# Altium project Zigbee_CC2538_GW.PrjPcb
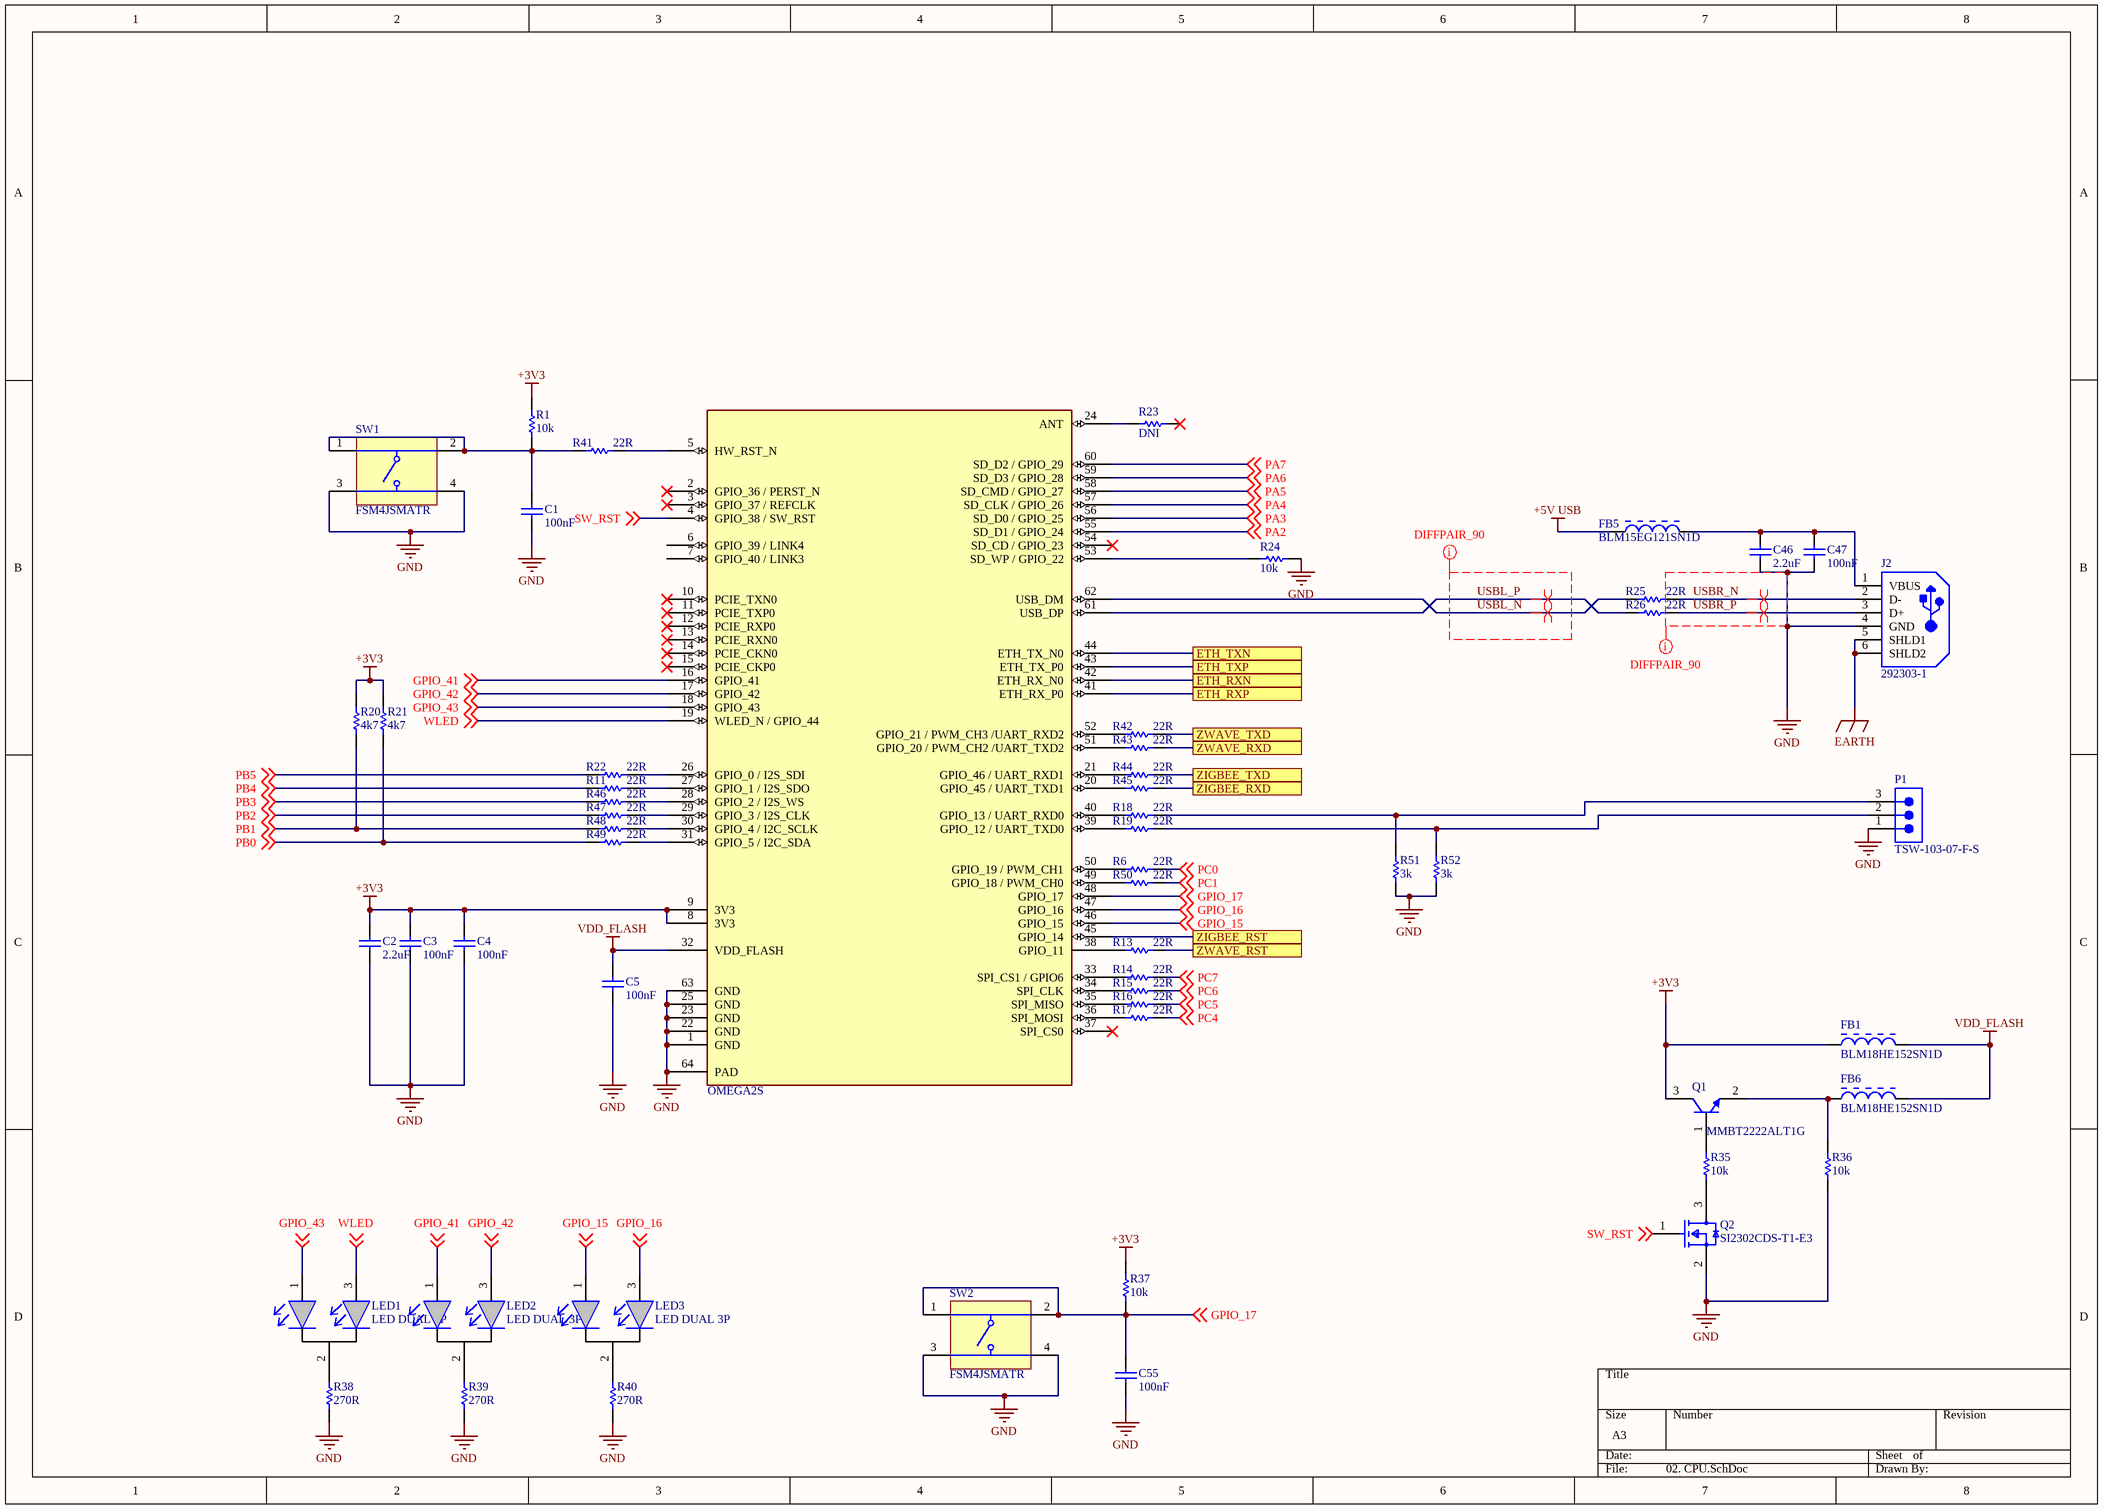
[diagram p0: 02. CPU.SchDoc]
6 sheets, 135 parts. Net scope: flat (ports and power ports of the same name join across sheets).
Board file: Zigbee_GW.PcbDoc
Sheets:
  02. CPU.SchDoc
  03. ZIGBEE.SchDoc
  01. MAIN.SchDoc
  04. Z-WAVE.SchDoc
  06. ETHERNET.SchDoc
  07. POWER.SchDoc

## Sheet 02. CPU.SchDoc
size A3

### Parts
C1  100nF  [CAPC1005X56X25NL10T15]
C2  2.2uF  [CAPC1608X90X35NL10T15]
C3  100nF  [CAPC1005X56X25NL10T15]
C4  100nF  [CAPC1005X56X25NL10T15]
C5  100nF  [CAPC1005X56X25NL10T15]
C46  2.2uF  [CAPC1608X90X35NL10T15]
C47  100nF  [CAPC1005X56X25NL10T15]
C55  100nF  [CAPC1005X56X25NL10T15]
FB1  BLM18HE152SN1D  [MURA-BLM18-RF-H4-CHIP-2_V]
FB5  BLM15EG121SN1D  [MURA-BLM15-CHIP-2_V]
FB6  BLM18HE152SN1D  [MURA-BLM18-RF-H4-CHIP-2_V]
J2  292303-1  [TE-292303-1_V]
LED1  LED DUAL 3P  [LED 3P 2.54]
LED2  LED DUAL 3P  [LED 3P 2.54]
LED3  LED DUAL 3P  [LED 3P 2.54]
P1  TSW-103-07-F-S  [SMTC-TSW-103-07-X-S]
Q1  MMBT2222ALT1G  [ONSC-SOT-23-3-318-08_V]
Q2  SI2302CDS-T1-E3  [FP-S-03946-MFG]
R1  10k  [RESC1005X40X25NL05T05]
R6  22R  [RESC1005X40X25LL05T05]
R11  22R  [RESC1005X40X25LL05T05]
R13  22R  [RESC1005X40X25LL05T05]
R14  22R  [RESC1005X40X25LL05T05]
R15  22R  [RESC1005X40X25LL05T05]
R16  22R  [RESC1005X40X25LL05T05]
R17  22R  [RESC1005X40X25LL05T05]
R18  22R  [RESC1005X40X25LL05T05]
R19  22R  [RESC1005X40X25LL05T05]
R20  4k7  [RESC1005X40X25NL05T05]
R21  4k7  [RESC1005X40X25NL05T05]
R22  22R  [RESC1005X40X25LL05T05]
R23  DNI  [RESC1005X40X25NL05T05]
R24  10k  [RESC1005X40X25NL05T05]
R25  22R  [RESC1005X40X25NL05T05]
R26  22R  [RESC1005X40X25NL05T05]
R35  10k  [RESC1005X40X25NL05T05]
R36  10k  [RESC1005X40X25NL05T05]
R37  10k  [RESC1005X40X25NL05T05]
R38  270R  [RESC1609X55X30NL15T15]
R39  270R  [RESC1609X55X30NL15T15]
R40  270R  [RESC1609X55X30NL15T15]
R41  22R  [RESC1005X40X25LL05T05]
R42  22R  [RESC1005X40X25LL05T05]
R43  22R  [RESC1005X40X25LL05T05]
R44  22R  [RESC1005X40X25LL05T05]
R45  22R  [RESC1005X40X25LL05T05]
R46  22R  [RESC1005X40X25LL05T05]
R47  22R  [RESC1005X40X25LL05T05]
R48  22R  [RESC1005X40X25LL05T05]
R49  22R  [RESC1005X40X25LL05T05]
R50  22R  [RESC1005X40X25LL05T05]
R51  3k  [RESC1005X40X25LL05T05]
R52  3k  [RESC1005X40X25LL05T05]
SW1  FSM4JSMATR  [TECO-FSM4JSMATR_V]
SW2  FSM4JSMATR  [TECO-FSM4JSMATR_V]
  OMEGA2S  [OMEGA2S]

### Ports
ETH_RXN, ETH_RXP, ETH_TXN, ETH_TXP, ZIGBEE_RST, ZIGBEE_RXD, ZIGBEE_TXD, ZWAVE_RST, ZWAVE_RXD, ZWAVE_TXD

### Nets
+3V3: C2.2 C3.2 C4.2 FB1.1 Q1.3(C) R1.2 R20.2 R21.2 R37.2 .8(3V3) .9(3V3)
+5V USB: FB5.1
EARTH: J2.5(SHLD1) J2.6(SHLD2)
GND: C1.1 C2.1 C3.1 C4.1 C5.1 C46.1 C47.1 C55.1 J2.4(GND) P1.1 Q2.2(S) R24.1 R36.2 R38.1 R39.1 R40.1 R51.1 R52.1 SW1.3 SW1.4 SW2.3 SW2.4 .1(GND) .22(GND) .23(GND) .25(GND) .63(GND) .64(PAD)
VDD_FLASH: C5.2 FB1.2 FB6.2 .32(VDD_FLASH)
ETH_RX_N: .42(ETH_RX_N0) ; port ETH_RXN
ETH_RX_P: .41(ETH_RX_P0) ; port ETH_RXP
ETH_TX_N: .44(ETH_TX_N0) ; port ETH_TXN
ETH_TX_P: .43(ETH_TX_P0) ; port ETH_TXP
GPIO_15: LED3.1 .46(GPIO_15) ; off-sheet GPIO_15
GPIO_16: LED3.3 .47(GPIO_16) ; off-sheet GPIO_16
GPIO_17: C55.2 R37.1 SW2.1 SW2.2 .48(GPIO_17) ; off-sheet GPIO_17
GPIO_41: LED2.1 .16(GPIO_41) ; off-sheet GPIO_41
GPIO_42: LED2.3 .17(GPIO_42) ; off-sheet GPIO_42
GPIO_43: LED1.1 .18(GPIO_43) ; off-sheet GPIO_43
PA2: .55(SD_D1_/_GPIO_24) ; off-sheet PA2
PA3: .56(SD_D0_/_GPIO_25) ; off-sheet PA3
PA4: .57(SD_CLK_/_GPIO_26) ; off-sheet PA4
PA5: .58(SD_CMD_/_GPIO_27) ; off-sheet PA5
PA6: .59(SD_D3_/_GPIO_28) ; off-sheet PA6
PA7: .60(SD_D2_/_GPIO_29) ; off-sheet PA7
PB0: R21.1 R49.1 ; off-sheet PB0
PB1: R20.1 R48.1 ; off-sheet PB1
PB2: R47.1 ; off-sheet PB2
PB3: R46.1 ; off-sheet PB3
PB4: R11.1 ; off-sheet PB4
PB5: R22.1 ; off-sheet PB5
PC0: R6.2 ; off-sheet PC0
PC1: R50.2 ; off-sheet PC1
PC4: R17.2 ; off-sheet PC4
PC5: R16.2 ; off-sheet PC5
PC6: R15.2 ; off-sheet PC6
PC7: R14.2 ; off-sheet PC7
SW_RST: Q2.1(G) .4(GPIO_38_/_SW_RST) ; off-sheet SW_RST
USBL_N: R25.2 .62(USB_DM)
USBL_P: R26.2 .61(USB_DP)
USBR_N: J2.2(D-) R25.1
USBR_P: J2.3(D+) R26.1
WLED: LED1.3 .19(WLED_N_/_GPIO_44) ; off-sheet WLED
NetC1_2: C1.2 R1.1 R41.1 SW1.1 SW1.2
NetC36_2: R13.2 ; port ZWAVE_RST
NetC46_2: C46.2 C47.2 FB5.2 J2.1(VBUS)
NetFB6_1: FB6.1 Q1.2(E) R36.1
NetLED1_2: LED1.2 R38.2
NetLED2_2: LED2.2 R39.2
NetLED3_2: LED3.2 R40.2
NetP1_2: P1.2 R19.2 R52.2
NetP1_3: P1.3 R18.2 R51.2
NetQ1_1: Q1.1(B) R35.1
NetQ2_3: Q2.3(D) R35.2
NetR6_1: R6.1 .50(GPIO_19_/_PWM_CH1)
NetR11_2: R11.2 .27(GPIO_1_/_I2S_SDO)
NetR12_1: .45(GPIO_14) ; port ZIGBEE_RST
NetR13_1: R13.1 .38(GPIO_11)
NetR14_1: R14.1 .33(SPI_CS1_/_GPIO6)
NetR15_1: R15.1 .34(SPI_CLK)
NetR16_1: R16.1 .35(SPI_MISO)
NetR17_1: R17.1 .36(SPI_MOSI)
NetR18_1: R18.1 .40(GPIO_13_/_UART_RXD0)
NetR19_1: R19.1 .39(GPIO_12_/_UART_TXD0)
NetR22_2: R22.2 .26(GPIO_0_/_I2S_SDI)
NetR23_2: R23.2 .24(ANT)
NetR24_2: R24.2 .53(SD_WP_/_GPIO_22)
NetR41_2: R41.2 .5(HW_RST_N)
NetR42_1: R42.1 .52(GPIO_21_/_PWM_CH3_/UART_RXD2)
NetR42_2: R42.2 ; port ZWAVE_TXD
NetR43_1: R43.1 .51(GPIO_20_/_PWM_CH2_/UART_TXD2)
NetR43_2: R43.2 ; port ZWAVE_RXD
NetR44_1: R44.1 .21(GPIO_46_/_UART_RXD1)
NetR44_2: R44.2 ; port ZIGBEE_TXD
NetR45_1: R45.1 .20(GPIO_45_/_UART_TXD1)
NetR45_2: R45.2 ; port ZIGBEE_RXD
NetR46_2: R46.2 .28(GPIO_2_/_I2S_WS)
NetR47_2: R47.2 .29(GPIO_3_/_I2S_CLK)
NetR48_2: R48.2 .30(GPIO_4_/_I2C_SCLK)
NetR49_2: R49.2 .31(GPIO_5_/_I2C_SDA)
NetR50_1: R50.1 .49(GPIO_18_/_PWM_CH0)

Not connected (* = marked no-connect by the designer): R23 1*;  2(GPIO_36_/_PERST_N)* 3(GPIO_37_/_REFCLK)* 6(GPIO_39_/_LINK4) 7(GPIO_40_/_LINK3) 10(PCIE_TXN0)* 11(PCIE_TXP0)* 12(PCIE_RXP0)* 13(PCIE_RXN0)* 14(PCIE_CKN0)* 15(PCIE_CKP0)* 37(SPI_CS0)* 54(SD_CD_/_GPIO_23)*

### Layout directives
differential pair: USBL_N, USBL_P, USBR_N, USBR_P
net class USB; rule Matched Net Lengths [Tolerance = 10mil]: USBL_N, USBL_P, USBR_N, USBR_P

### Library data of the parts
C1 C3-C5 C47 C55 = CMP-2008-02743-1: Manufacturer: AVX Interconnect / Elco; Part Number: 04026D104KAT2A
C2 C46 = CMP-2006-02354-1: Manufacturer: Murata; Part Number: GCM188R70J225KE22D
FB1 FB6 = CMP-0686-00368-2: Chip Ferrite Bead for GHz Band High-speed Signal Lines, 1500 Ohm, 500 mA, -55 to 125 degC, 1.6 x 0.8 x 0.95 mm SMD, Tape and Reel; Manufacturer: Murata; Rated Current: 500 mA; Impedance (at 100 MHz): 1500 Ohm +/- 25%; DC Resistance: 0.50 Ohm Max.; Packing: Tape and Reel; DatasheetVersion: 08/2013; ComponentLink1URL: http://www.murata.com/; Mounting Technology: Surface Mount; ComponentLink2URL: http://www.murata.com/products/catalog/pdf/c31e.pdf; ComponentLink3Description: Package Specification; ComponentLink2Description: Datasheet; PackageReference: BLM18_H950-2; ComponentLink1Description: Manufacturer URL; PackageDescription: 2-Pin Chip, Body 1.6 x 0.8 mm; ComponentLink3URL: http://www.murata.com/products/catalog/pdf/c31e.pdf; PartNumber: BLM18HE152SN1D; Operating Temperature Range: -55 to 125 degC
FB5 = CMP-0686-00148-3: Chip Ferrite Bead for GHz Band General Use (Low DC Resistance Type), 120 Ohm, 1500 mA, -55 to 125 degC, 1 x 0.5 x 0.55 mm SMD, Tape and Reel; Manufacturer: Murata; Rated Current: 1500 mA; Impedance (at 100 MHz): 120 Ohm +/- 25%; DC Resistance: 0.095 Ohm Max.; ComponentLink3URL: http://www.murata.com/products/catalog/pdf/c31e.pdf; ComponentLink1URL: http://www.murata.com/; Packing: Tape and Reel; Operating Temperature Range: -55 to 125 degC; PackageReference: BLM15-2; ComponentLink2Description: Datasheet; PackageDescription: 2-Pin Chip, Body 1 x 0.5 mm; ComponentLink2URL: http://www.murata.com/products/catalog/pdf/c31e.pdf; Mounting Technology: Surface Mount; ComponentLink3Description: Package Specification; ComponentLink1Description: Manufacturer URL; PartNumber: BLM15EG121SN1D; DatasheetVersion: 08/2013
J2 = CMP-2000-05404-1: 1 Port Right Angle Through Hole Mount Female Type A USB Connector, 4 Position, -55 to 85 degC, RoHS, Tube; Manufacturer: TE Connectivity; Contact Termination Type: Solder; No. of Contacts: 4; Connector Mounting: PCB; SVHC: NoSVHC(16-Jun-2014); Gender: Receptacle; Connector Type: USBA; Package Description: 4-Pin Through Hole Device, Body 14 x 13.13 mm, Pitch 2.5 mm; Contact Plating: Gold; Package Reference: 292303-1; Contact Material: Copper; Datasheet URL: http://www.farnell.com/cad/1653030.pdf; Datasheet Version: Feb-12; Manufacturer URL: http://www.te.com/
P1 = CMP-1024-00331-1: 0.025" SQ Post Header, Through-hole, Vertical, -55 to 125 degC, 2.54 mm Pitch, 3-Pin, Male, RoHS; Manufacturer: Samtec; Pitch: 2.54 mm; DatasheetVersion: F-214; ComponentLink1Description: Manufacturer URL; ComponentLink3URL: http://www.samtec.com/documents/webfiles/cpdf/TSW-XXX-XX-XXX-X-XX-XXX-MKT.pdf; Mounting Technology: Through-hole; PackageDescription: .025[0.64] SQ. Post Terminal Strip Assembly; Temperature Range: -55 to 125 degC; ComponentLink3Description: Package Specification; Orientation: Vertical; PartNumber: TSW-103-07-F-S; RoHS: True; PackageVersion: DM, 8/1988; ComponentLink2Description: Datasheet; ComponentLink1URL: http://www.samtec.com; ComponentLink2URL: http://www.samtec.com/documents/webfiles/pdf/TSW_TH.PDF; PackageReference: TSW-103-07-X-S
Q1 = CMP-1048-00538-1: General Purpose Transistor, NPN Silicon, 3-Pin SOT-23, Pb-Free, Tape and Reel; Manufacturer: On Semiconductor; fT Min (MHz): 300; IC Continuous (A): 0.6; ComponentLink3URL: http://www.onsemi.cn/pub_link/Collateral/318-08.PDF; PartNumber: MMBT2222ALT1G; RoHS: TRUE; ComponentLink1URL: http://www.onsemi.com/; ComponentLink3Description: Package Specification; ComponentLink2Description: Datasheet; Mounting Technology: Surface Mount; Packing: Tape and Reel; PackageDescription: 3-Pin Small Outline Transistor, Body 2.92 x 1.3 mm, Pitch 0.95 mm; DatasheetVersion: Rev. 10; PackageReference: SOT-23-3-318-08; ComponentLink2URL: http://www.onsemi.cn/pub_link/Collateral/MMBT2222LT1-D.PDF; Polarity: NPN; PackageVersion: Rev. AP, 11/2009; ComponentLink1Description: Manufacturer URL
Q2 = CMP-02550-000184-1: MOSFET N-CH 20V 2.6A SOT-23; Manufacturer: Vishay; Gate To Source Voltage: 8V; Max Forward Diode Voltage: 1.2V; Pulse Drain Current: 10A; Typ Forward Diode Voltage: 0.7V; Number Of N Channels: 1; Reverse Recovery Charge: 2nC; Power Dissipation: 0.71W; Reverse Recovery Time: 8.5ns; Threshold Vgs Min: 0.4V; Drain To Source Resistance: 0.045Ω; Gate Charge At Vgs: 3.5nC @ 4.5V; Turn Off Delay Time: 30ns; Rthja Max: 140°C/W; Max Junction Temp: +150°C; Transconductance: 13S; Depletion Mode: False; Standoff Height: 0.01mm; Turn On Delay Time: 8ns; Threshold Vgs Max: 0.85V; Manufacturer Part Number: SI2302CDS-T1-E3; Mouser Description: MOSFET 20V 2.9A 0.86W 57mohm @ 4.5V; Digikey Description: MOSFET N-CH 20V 2.6A SOT-23; Drain To Source Voltage: 20V; Lead Free: Yes; Temperature Range High: +150°C; Automotive: No; ComponentLink2URL: http://www.vishay.com/docs/68645/si2302cds.pdf; Height: 1.12mm; ComponentLink2Description: Datasheet; Octopart: https://octopart.com/si2302cds-t1-e3-vishay-44452855; Continuous Drain Current: 2.6A; Drain To Source Breakdown Voltage: 20V; Number Of Channels: 1; Device Class L3: MOSFETs; Device Class L1: Discrete Semiconductors; Temperature Range Low: -55°C; Package: S-03946; RoHS: TRUE; Device Class L2: Transistors; Temperature: -55°C to +150°C; Category: Trans
R1 R20 R21 R23-R26 R35-R37 = CMP-2002-08135-1: Manufacturer: Vishay Dale; Part Number: CRCW040210K0FKED
R6 R11 R13-R19 R22 R41-R52 = CMP-1665-00027-3: Chip Resistor, 22 Ohm, +/- 1%, 0.1 W, -55 to 155 degC, 0402 (1005 Metric), RoHS, Tape and Reel; PartNumber: ERJ-2RKF22R0X; Case\/Package: 0402; Resistance: 22 Ohm; Power Rating: 100 mW; Voltage Rating: 50 V; ComponentLink2Description: Datasheet; Packaging: Tape and Reel; Weight: 2.8E-05oz; Pins: 2; Case Code (Imperial): 0402; Width: 0.5 mm; ComponentLink2URL: http://industrial.panasonic.com/cdbs/www-data/pdf/RDA0000/AOA0000C86.pdf; Height: 0.35 mm; PackageReference: 0402; REACH SVHC: Yes; Min Operating Temperature: -55 degC; Length: 1 mm; DatasheetVersion: 04/2015; RoHSCompliant: true; Package Quantity: 10000; Case Code (Metric): 1005; PackageDescription: 2-Pin Surface Mount Device, Body 1 x 0.5 mm; ComponentLink1URL: http://www.panasonic.com/; Mount: Surface Mount; Mounting Technology: Surface Mount; Tolerance: 1%; Max Operating Temperature: 155 degC; ComponentLink1Description: Manufacturer URL
R38-R40 = CMP-2000-07452-1: Chip Resistor, 10 KOhm, +/- 1%, 0.1 W, -55 to 155 degC, 0603 (1608 Metric), RoHS, Tape and Reel; Manufacturer: Panasonic; Voltage Rating: 75V; Case\/Package: 0603; Power Rating: 100mW; Resistance: 10KOhm; Temperature Coefficient: 100ppm\/degreesC; Number of Pins: 2; Package Reference: 603; Depth: 0.8mm; Mount: SurfaceMount; Package Description: 2-Pin Surface Mount Device, Body 1.6 x 0.85 mm; Datasheet Version: 02/2017; Length: 1.6mm; Lead Free: LeadFree; Height: 0.45mm; Number of Terminations: 2; Max Power Dissipation: 100mW; Min Operating Temperature: -55degC; Datasheet URL: https://industrial.panasonic.com/cdbs/www-data/pdf/RDA0000/AOA0000C304.pdf; Termination: SMD/SMT; Case Code (Metric): 1608; Case Code (Imperial): 0603; Tolerance: 1%; Max Operating Temperature: 155degC; RoHSCompliant: true; Voltage Rating (DC): 75V; Radiation Hardening: No; Packaging: TapeandReel; Composition: ThickFilm; Mounting Technology: SurfaceMount; Manufacturer URL: http://www.panasonic.com/; Width: 0.031inch; REACH SVHC: NoSVHC; Contact Plating: Tin; Military Standard: Not; Package Quantity: 1
SW1 SW2 = CMP-2000-07486-1: Micro Miniature Push Button Switch FSM JSM, 50 mA, -35 to 85 degC, 4-Pin SMD, RoHS, Tape and Reel; Manufacturer: TE Connectivity; Mechanical Life: 100000Cycles; Current Rating: 50mA; Actuator Material: Polyamide; Max Voltage Rating (DC): 12V; Capacitance: 0f; Illumination Type: Illuminated; Voltage Rating (DC): 24V; Case\/Package: SMD/SMT; Operating Force: 160gf; Contact Resistance: 100mOhm; Actuator Length: 0.055inch; Switch Travel: 0.25mm; Throw Configuration: SPST; Termination: GullWing; Contact Plating: Silver; Orientation: Straight; Mounting Technology: SurfaceMount; REACH SVHC: Unknown; Electrical Life: 100000Cycles; Package Reference: FSM4JSMATR; Max Operating Temperature: 85degC; Manufacturer URL: http://www.te.com/; Package Description: 4-Pin Surface Mount Device, Body 6 x 6 mm, Pitch 4.5 mm; Datasheet Version: Rev. V, 02/2015; Packaging: TapeandReel; Min Operating Temperature: -35degC; Mount: SurfaceMount; Contact Current Rating: 50mA; Contact Material: CopperAlloy; Package Quantity: 1200; Datasheet URL: http://www.te.com/commerce/DocumentDelivery/DDEController?Action=showdoc&DocId=Customer+Drawing%7F2-1437565-7%7FV%7Fpdf%7FEnglish%7FENG_CD_2-1437565-7_V.pdf%7F4-1437565-2; RoHSCompliant: true
 = OMEGA2S: MediaTek Transceiver; 802.11 b/g/n _Wi-Fi, WiFi, WLAN_ For Use With MT7688; MF: Onion

## Sheet 03. ZIGBEE.SchDoc
size A3
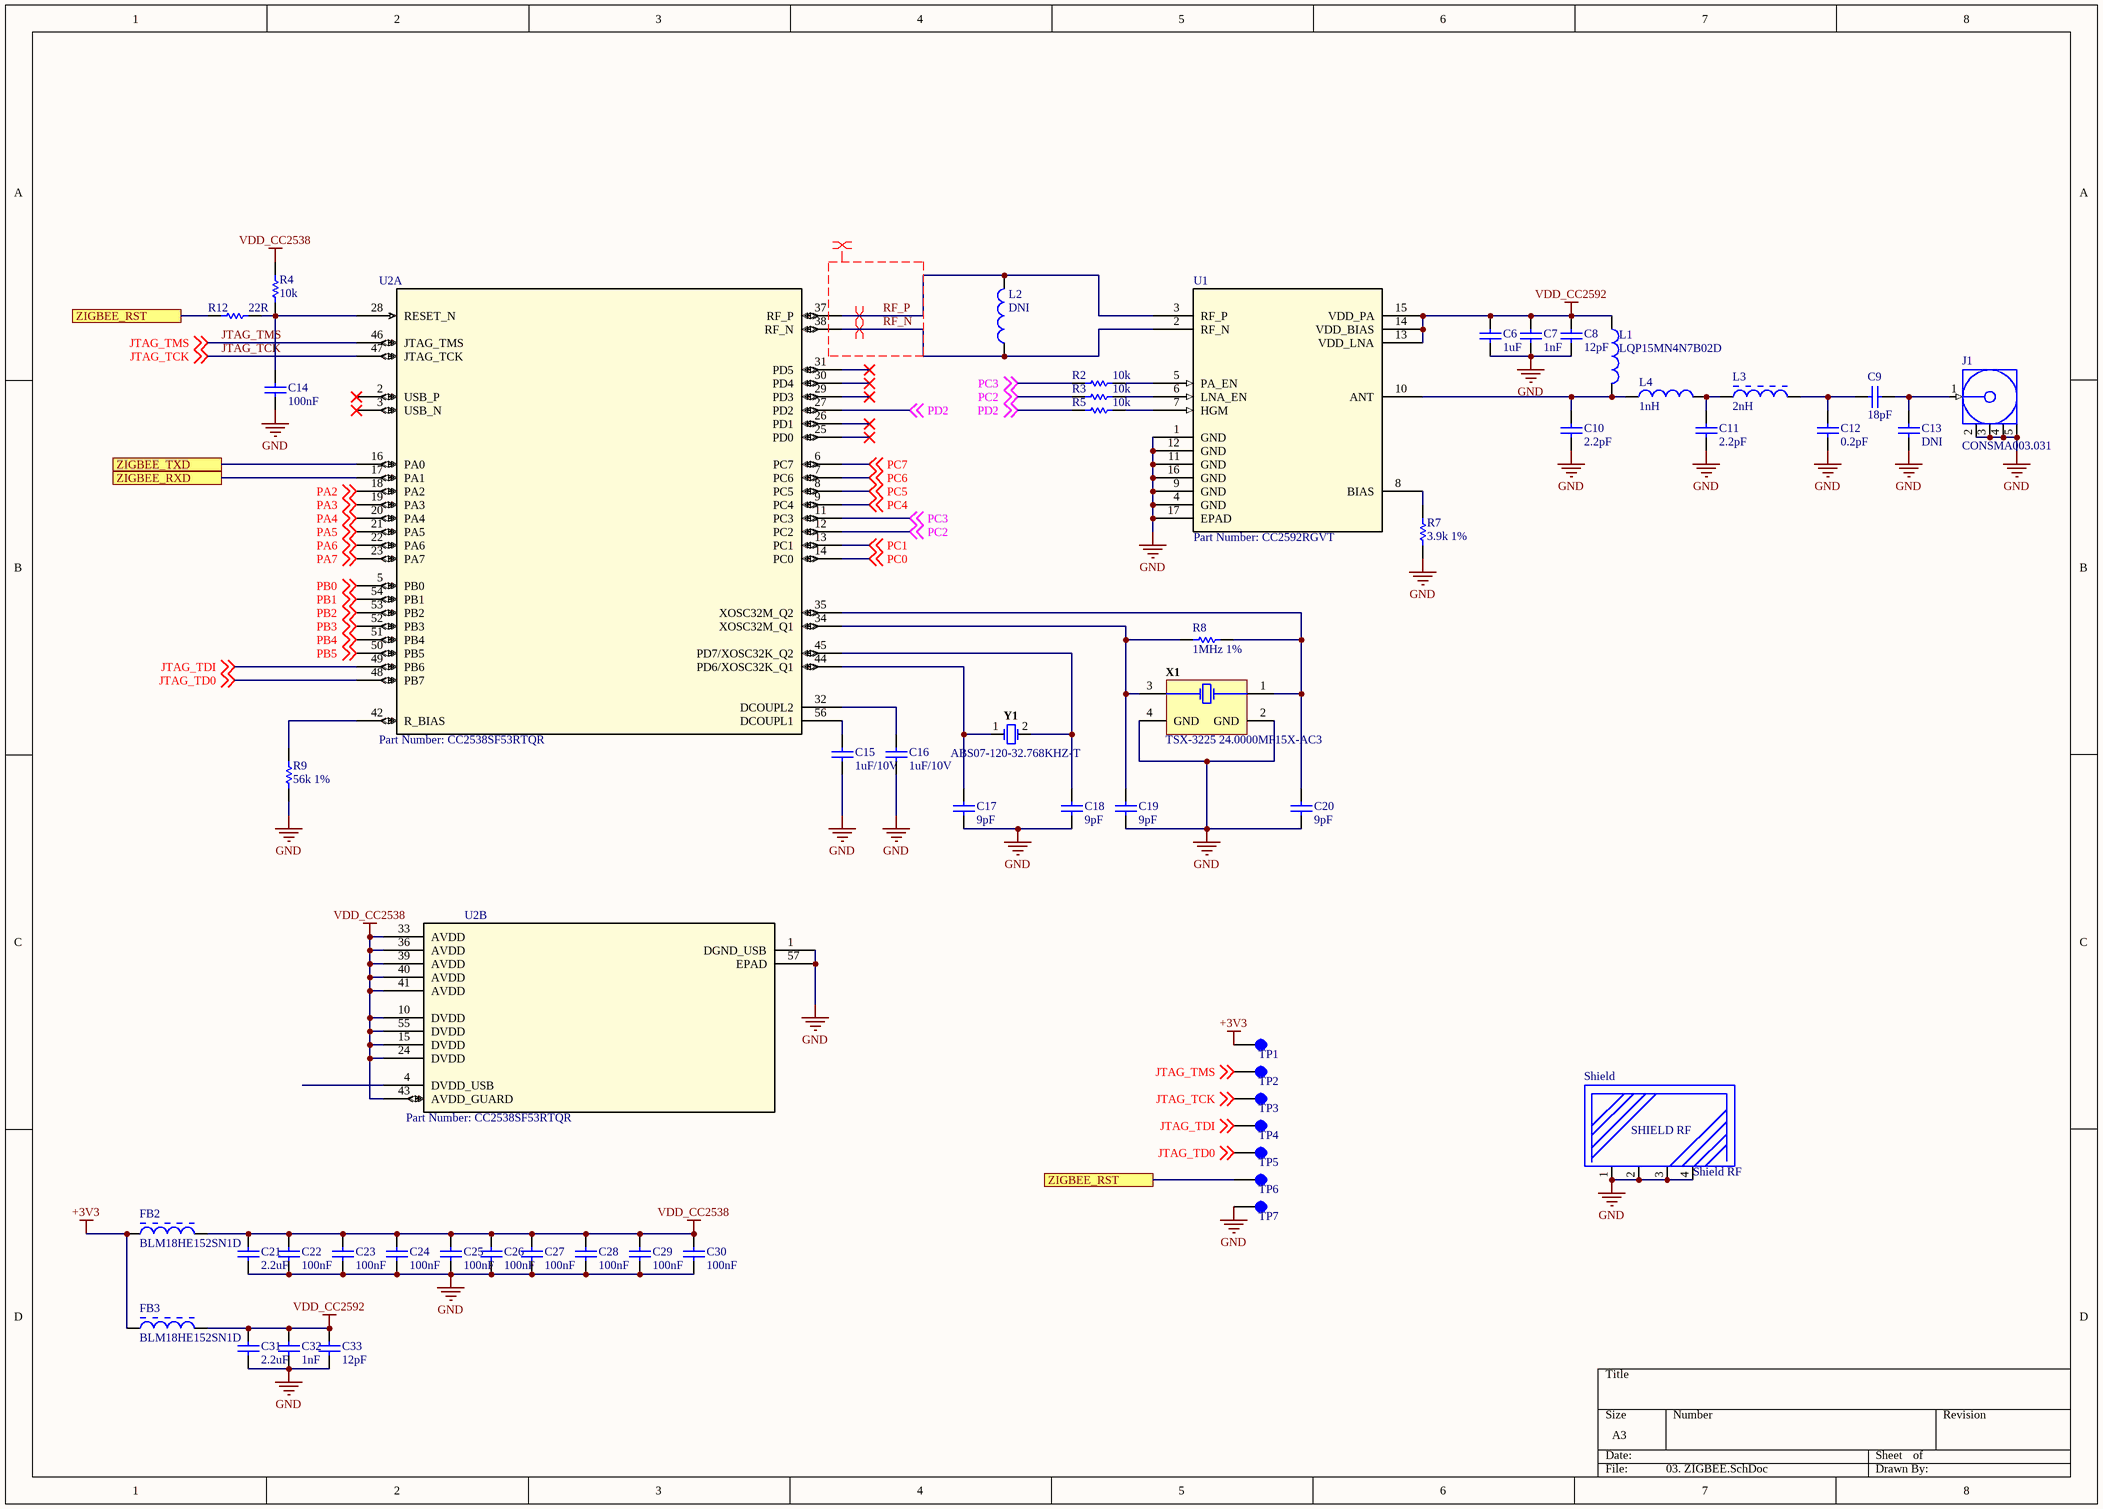
[diagram p1: 03. ZIGBEE.SchDoc]

### Parts
C6  1uF  [CAPC1608X90X20NL10]
C7  1nF  [CAPC1005X55X25NL05T10]
C8  12pF  [CAPC1005X55X25NL05T10]
C9  18pF  [CAPC1005X55X25NL05T10]
C10  2.2pF  [CAPC1005X55X25NL05T10]
C11  2.2pF  [CAPC1005X55X25NL05T10]
C12  0.2pF  [CAPC1005X55X25NL05T10]
C13  DNI  [CAPC1005X55X25NL05T10]
C14  100nF  [CAPC1005X56X25NL10T15]
C15  1uF/10V  [CAPC1005X55X25NL05T10]
C16  1uF/10V  [CAPC1005X55X25NL05T10]
C17  9pF  [CAPC1005X55X25NL05T10]
C18  9pF  [CAPC1005X55X25NL05T10]
C19  9pF  [CAPC1005X55X25NL05T10]
C20  9pF  [CAPC1005X55X25NL05T10]
C21  2.2uF  [CAPC1608X90X35NL10T15]
C22  100nF  [CAPC1005X56X25NL10T15]
C23  100nF  [CAPC1005X56X25NL10T15]
C24  100nF  [CAPC1005X56X25NL10T15]
C25  100nF  [CAPC1005X56X25NL10T15]
C26  100nF  [CAPC1005X56X25NL10T15]
C27  100nF  [CAPC1005X56X25NL10T15]
C28  100nF  [CAPC1005X56X25NL10T15]
C29  100nF  [CAPC1005X56X25NL10T15]
C30  100nF  [CAPC1005X56X25NL10T15]
C31  2.2uF  [CAPC1608X90X35NL10T15]
C32  1nF  [CAPC1005X55X25NL05T10]
C33  12pF  [CAPC1005X55X25NL05T10]
FB2  BLM18HE152SN1D  [MURA-BLM18-RF-H4-CHIP-2_V]
FB3  BLM18HE152SN1D  [MURA-BLM18-RF-H4-CHIP-2_V]
J1  CONSMA003.031  [CON-SMA-EDGE031]
L1  LQP15MN4N7B02D  [INDC1005X45X25LL10T10]
L2  DNI  [INDC1005X45X25NL10T10]
L3  2nH  [MURA-IND0402_V]
L4  1nH  [INDC1005X45X25NL10T10]
R2  10k  [RESC1005X40X25NL05T05]
R3  10k  [RESC1005X40X25NL05T05]
R4  10k  [RESC1005X40X25NL05T05]
R5  10k  [RESC1005X40X25NL05T05]
R7  3.9k 1%  [RESC1005X40X25NL05T05]
R8  1MHz 1%  [RESC1005X40X25NL05T05]
R9  56k 1%  [RESC1005X40X25NL05T05]
R12  22R  [RESC1005X40X25LL05T05]
Shield  Shield RF  [NSTRFShield]
TP1  Test Point  [TP]  (value not drawn)
TP2  Test Point  [TP]  (value not drawn)
TP3  Test Point  [TP]  (value not drawn)
TP4  Test Point  [TP]  (value not drawn)
TP5  Test Point  [TP]  (value not drawn)
TP6  Test Point  [TP]  (value not drawn)
TP7  Test Point  [TP]  (value not drawn)
U1  Part Number: CC2592RGVT  [QFN16_2P16X2P16]
U2  Part Number: CC2538SF53RTQR  [QFN56_6P7X6P7]  (parts A,B of 2)
X1  TSX-3225 24.0000MF15X-AC3  [FP-NX3225SA-MFG]
Y1  ABS07-120-32.768KHZ-T  [ABRA-ABS07_A_V]

### Ports
ZIGBEE_RST, ZIGBEE_RXD, ZIGBEE_TXD

### Nets
+3V3: FB2.1 FB3.1 TP1.1
GND: C6.1 C7.1 C8.1 C10.1 C11.1 C12.1 C13.1 C14.1 C15.1 C16.1 C17.1 C18.1 C19.1 C20.1 C21.1 C22.1 C23.1 C24.1 C25.1 C26.1 C27.1 C28.1 C29.1 C30.1 C31.1 C32.1 C33.1 J1.2(GND) J1.3(GND) J1.4(GND) J1.5(GND) R7.1 R9.1 Shield.1 Shield.2 Shield.3 Shield.4 TP7.1 U1.1(GND) U1.4(GND) U1.9(GND) U1.11(GND) U1.12(GND) U1.16(GND) U1.17(EPAD) U2.1(DGND_USB) U2.57(EPAD) X1.2(GND) X1.4(GND)
VDD_CC2538: C21.2 C22.2 C23.2 C24.2 C25.2 C26.2 C27.2 C28.2 C29.2 C30.2 FB2.2 R4.2 U2.10(DVDD) U2.15(DVDD) U2.24(DVDD) U2.33(AVDD) U2.36(AVDD) U2.39(AVDD) U2.40(AVDD) U2.41(AVDD) U2.43(AVDD_GUARD) U2.55(DVDD)
VDD_CC2592: C6.2 C7.2 C8.2 C31.2 C32.2 C33.2 FB3.2 L1.1 U1.13(VDD_LNA) U1.14(VDD_BIAS) U1.15(VDD_PA)
JTAG_TCK: TP3.1 U2.47(JTAG_TCK) ; off-sheet JTAG_TCK
JTAG_TD0: TP5.1 U2.48(PB7) ; off-sheet JTAG_TD0
JTAG_TDI: TP4.1 U2.49(PB6) ; off-sheet JTAG_TDI
JTAG_TMS: TP2.1 U2.46(JTAG_TMS) ; off-sheet JTAG_TMS
PA2: U2.18(PA2) ; off-sheet PA2
PA3: U2.19(PA3) ; off-sheet PA3
PA4: U2.20(PA4) ; off-sheet PA4
PA5: U2.21(PA5) ; off-sheet PA5
PA6: U2.22(PA6) ; off-sheet PA6
PA7: U2.23(PA7) ; off-sheet PA7
PB0: U2.5(PB0) ; off-sheet PB0
PB1: U2.54(PB1) ; off-sheet PB1
PB2: U2.53(PB2) ; off-sheet PB2
PB3: U2.52(PB3) ; off-sheet PB3
PB4: U2.51(PB4) ; off-sheet PB4
PB5: U2.50(PB5) ; off-sheet PB5
PC0: U2.14(PC0) ; off-sheet PC0
PC1: U2.13(PC1) ; off-sheet PC1
PC2: R3.1 U2.12(PC2) ; off-sheet PC2
PC3: R2.1 U2.11(PC3) ; off-sheet PC3
PC4: U2.9(PC4) ; off-sheet PC4
PC5: U2.8(PC5) ; off-sheet PC5
PC6: U2.7(PC6) ; off-sheet PC6
PC7: U2.6(PC7) ; off-sheet PC7
PD2: R5.1 U2.27(PD2) ; off-sheet PD2
RF_N: L2.1 U1.2(RF_N) U2.38(RF_N)
RF_P: L2.2 U1.3(RF_P) U2.37(RF_P)
NetC9_1: C9.1 C12.2 L3.2
NetC9_2: C9.2 C13.2 J1.1(Signal)
NetC10_2: C10.2 L1.2 L4.1 U1.10(ANT)
NetC11_2: C11.2 L3.1 L4.2
NetC14_2: C14.2 R4.1 R12.2 U2.28(RESET_N)
NetC15_2: C15.2 U2.56(DCOUPL1)
NetC16_2: C16.2 U2.32(DCOUPL2)
NetC17_2: C17.2 U2.44(PD6/XOSC32K_Q1) Y1.1
NetC18_2: C18.2 U2.45(PD7/XOSC32K_Q2) Y1.2
NetC19_2: C19.2 R8.1 U2.34(XOSC32M_Q1) X1.3(X2)
NetC20_2: C20.2 R8.2 U2.35(XOSC32M_Q2) X1.1(X1)
NetR2_2: R2.2 U1.5(PA_EN)
NetR3_2: R3.2 U1.6(LNA_EN)
NetR5_2: R5.2 U1.7(HGM)
NetR7_2: R7.2 U1.8(BIAS)
NetR9_2: R9.2 U2.42(R_BIAS)
NetR12_1: R12.1 TP6.1 ; port ZIGBEE_RST
NetR44_2: U2.16(PA0) ; port ZIGBEE_TXD
NetR45_2: U2.17(PA1) ; port ZIGBEE_RXD

Not connected (* = marked no-connect by the designer): U2 2(USB_P)* 3(USB_N)* 4(DVDD_USB) 25(PD0)* 26(PD1)* 29(PD3)* 30(PD4)* 31(PD5)*

### Layout directives
differential pair: RF_N, RF_P
net class ZIGBEE_RF; rule Matched Net Lengths [Tolerance = 10mil]: RF_N, RF_P

### Notes on the sheet
- (in symbol Shield RF) SHIELD RF

### Library data of the parts
C6 = CMP-2000-06025-1: Chip Capacitor, 1 uF, +/- 10%, 50 V, -55 to 85 degC, 0603 (1608 Metric), RoHS, Tape and Reel; Manufacturer: TDK; PCN Part Number: MLCCPartNumberChange30/Nov/2012; Other Names: 445-7468-6; Online Catalog: CSeries,GeneralPurpose; Capacitance: 1µF; Product Training Modules: CSeriesGeneralApplicationsSEAT,CCV,andTVCLDesignToolsGuidetoReplacinganElectrolyticCapacitorwithanMLCC; Voltage - Rated: 50V; Design Resources: 20WNon-IsolatedBuckLEDDriverUsingPLLNK460KG; Temperature Coefficient: X5R; Series: C; Datasheet Version: 08/2016; Package Description: 2-Pin Surface Mount Device, Body 1.6 x 0.8 mm; Mounting Technology: SurfaceMount; Features: -; Size / Dimension: 0.063"Lx0.031"W(1.60mmx0.80mm); Lead Spacing: -; Operating Temperature: -55°C~85°C; Tolerance: ±10%; Height - Seated (Max): -; Mounting Type: SurfaceMount,MLCC; Ratings: -; Standard Package: 1; Applications: GeneralPurpose; Datasheet URL: https://product.tdk.com/info/en/catalog/datasheets/mlcc_commercial_general_en.pdf; Category: Capacitors; Lead Style: -; Packaging: Digi-Reel®; RoHS Information: RoHSCertificate-MLCC; Package / Case: 0603(1608Metric); Package Reference: 0603; Manufacturer URL: http://www.tdk.com/; Thickness (Max): 0.035"(0.90mm); Family: CeramicCapacitors
C7 C32 = CMP-2008-04254-1: Part Number: GRM1555C1H102JA01D; Manufacturer: Murata
C8 C33 = CMP-2008-03945-1: Part Number: GRM1555C1H120GA01D; Manufacturer: Murata
C9 C13 = CMP-2008-03748-1: Part Number: GJM1555C1H180GB01D; Manufacturer: Murata
C10 C11 = CMP-2008-03835-1: Part Number: GJM1555C1H2R2BB01D; Manufacturer: Murata
C12 = CMP-2008-03980-1: Part Number: GRM1555C1HR20WA01D; Manufacturer: Murata
C14 C22-C30 = CMP-2008-02743-1: as C1 on sheet 02. CPU
C15 C16 = CMP-2008-04556-1: Part Number: GRM155R61A105KE15D; Manufacturer: Murata
C17-C20 = CMP-2008-03890-1: Part Number: GJM1555C1H9R0CB01D; Manufacturer: Murata
C21 C31 = CMP-2006-02354-1: as C2 on sheet 02. CPU
FB2 FB3 = CMP-0686-00368-2: as FB1 on sheet 02. CPU; Packing: Tape and Reel; DatasheetVersion: 08/2013; ComponentLink1URL: http://www.murata.com/; Mounting Technology: Surface Mount; ComponentLink2URL: http://www.murata.com/products/catalog/pdf/c31e.pdf; ComponentLink3Description: Package Specification; ComponentLink2Description: Datasheet; PackageReference: BLM18_H950-2; ComponentLink1Description: Manufacturer URL; PackageDescription: 2-Pin Chip, Body 1.6 x 0.8 mm; ComponentLink3URL: http://www.murata.com/products/catalog/pdf/c31e.pdf; PartNumber: BLM18HE152SN1D; Operating Temperature Range: -55 to 125 degC
J1 = CMP-0168-00026-1: SMA Female Edge Mount Connector for 0.031" Thick Board; PCB_Layout: Pads complies with manufacturer's recommendation.; PackageReference: CON-SMA-EDGE031; PackageDescription: SMA Female Edge Mount Connector for 0.031" Thick Board, 7.9 mm Body Dia.; DatasheetVersion: rev1.0, Jul-2006; PackageVersion: rev1.0, Jul-2006
L1 = CMP-2000-06592-1: Chip Inductor, 4.7 nH, +/- 0.1 nH, 160 mA, -40 to 85 degC, 0402 (1005 Metric), RoHS, Tape and Reel; Manufacturer: Murata; Maximum DC Resistance: 600mOhm; Type: RFChip; Inductance: 4.7nH; Product Height: 0.45mm; Maximum DC Current: 160mA; Minimum Quality Factor: 13@500MHz; Rad Hard: No; Tolerance: 0.1nH; Product Depth: 0.6mm; Package Description: 2-Pin Surface Mount Device, Body 1 x 0.5 mm; Package Reference: 0402; Datasheet Version: 09/2010; Packaging: Tape&Reel; Manufacturer URL: http://www.murata.com/; Package/Case: 0402; Datasheet URL: http://search.murata.co.jp/Ceramy/image/img/PDF/ENG/L0075S0084LQP15M.pdf; Mounting Technology: SurfaceMount
L2 = CMP-2000-06590-1: Chip Inductor, 1.8 nH, +/- 0.1 nH, 280 mA, -40 to 85 degC, 0402 (1005 Metric), RoHS, Tape and Reel; Manufacturer: Murata; DC Resistance: 0.2O; Tolerance (nH): ±0.1nH; Rated Current-Max: 280mA; Inductance-Nom: 1.8nH; Manufacturer URL: http://www.murata.com/; Mounting Technology: SurfaceMount; Datasheet URL: http://search.murata.co.jp/Ceramy/image/img/PDF/ENG/L0075S0084LQP15M.pdf; Datasheet Version: 09/2010; Package Reference: 0402; Case Size/Dimension: 0402; Package Description: 2-Pin Surface Mount Device, Body 1 x 0.5 mm
L3 = CMP-0499-00001-3: Chip Inductor (Chip Coil) for High Frequency Multilayer, 2 +/- 0.3 nH, 300 mA, 0402 (1005), 180mm Paper Tape; Manufacturer: Murata; PartNumber: LQG15HS2N0S02D; Self Resonance Frequency (min.): 6000 MHz; Inductance Test Frequency: 100 MHz; Inductance: 2.0 nH +/- 0.3 nH; Rated Current (Itemp) (Based on Temperature rise): 300 mA; Max. Of DC Resistance: 0.1 ohm; Q (min.): 8; Operating Temperature Range: -55 to 125 degC; Mounting Technology: Surface Mount; PackageDescription: 2-Pin SMT Inductor, 1 x 0.5 mm Body; ComponentLink2URL: http://search.murata.co.jp/Ceramy/image/img/PDF/ENG/L0075S0083LQG15HS.pdf; ComponentLink1Description: Manufacturer URL; ComponentLink3URL: http://search.murata.co.jp/Ceramy/image/img/PDF/ENG/L0075S0083LQG15HS.pdf; ComponentLink1URL: http://www.murata.com/; ComponentLink2Description: Datasheet; RoHS: Yes; ComponentLink3Description: Package Specification; Q Test Frequency: 100 MHz; PackageReference: IND0402
L4 = CMP-1662-00009-1: Chip Inductor, 1 nH, +/- 0.1 nH, 400 mA, -40 to 85 degC, 0402 (1005 Metric), RoHS, Tape and Reel; PartNumber: LQP15MN1N0B02D; Height: 0.35 mm; Mounting Technology: Surface Mount; Radiation Hardening: No; Max Operating Temperature: 85 degC; Package Quantity: 10000; ComponentLink2Description: Datasheet; ComponentLink2URL: https://www.modelithics.com/models/Vendor/MuRata/LQP15M.pdf; RoHSCompliant: True; ComponentLink1Description: Manufacturer URL; Mount: Surface Mount; Width: 0.5 mm; Min Operating Temperature: -40 degC; Length: 1 mm; ComponentLink1URL: http://www.murata.com/; DatasheetVersion: 09/2010; PackageDescription: 2-Pin Surface Mount Device, Body 1 x 0.5 mm; Case/Package: 0402; Packaging: Tape and Reel
R2-R5 = CMP-2002-08135-1: as R1 on sheet 02. CPU
R7 = CMP-2002-08592-1: Manufacturer: Vishay Dale; Part Number: CRCW04023K90FKED
R8 = CMP-2002-08122-1: Part Number: CRCW04020000Z0ED; Manufacturer: Vishay Dale
R9 = CMP-2002-00101-1: Part Number: CRCW040256K0FKED; Manufacturer: Vishay Dale
R12 = CMP-1665-00027-3: as R6 on sheet 02. CPU; ComponentLink2Description: Datasheet; Packaging: Tape and Reel; Weight: 2.8E-05oz; Pins: 2; Case Code (Imperial): 0402; Width: 0.5 mm; ComponentLink2URL: http://industrial.panasonic.com/cdbs/www-data/pdf/RDA0000/AOA0000C86.pdf; Height: 0.35 mm; PackageReference: 0402; REACH SVHC: Yes; Min Operating Temperature: -55 degC; Length: 1 mm; DatasheetVersion: 04/2015; RoHSCompliant: true; Package Quantity: 10000; Case Code (Metric): 1005; PackageDescription: 2-Pin Surface Mount Device, Body 1 x 0.5 mm; ComponentLink1URL: http://www.panasonic.com/; Mount: Surface Mount; Mounting Technology: Surface Mount; Tolerance: 1%; Max Operating Temperature: 155 degC; ComponentLink1Description: Manufacturer URL
TP1-TP7 = TP
U1 = CC2592RGVT: No Description Available; Vendor: Texas Instruments; Built_By: EMA_UL_Team; Manufacturer_Part_Number: CC2592RGVT; Copyright: Copyright (C) 2018 Accelerated Designs. All rights reserved; RefDes: RefDes; Type: DEV; Value: Value
U2 = CC2538SF53RTQR: IC RF TxRx + MCU 802.15.4 6LoWPAN, Zigbee® 2.4GHz 56-VFQFN Exposed Pad; Vendor: Texas Instruments; Built_By: EMA_UL_Team; Manufacturer_Part_Number: CC2538SF53RTQR; Copyright: Copyright (C) 2018 Accelerated Designs. All rights reserved; RefDes: RefDes; Type: DEV; Value: Value
X1 = CMP-2000-07333-1: MHz Range Crystal, 24 MHz, -40 to 85 degC, 4-Pin SMD, RoHS, Tape and Reel; Manufacturer: Epson; Brand: EpsonTiming; Frequency Stability: 10PPM; Frequency: 24MHz; ESR: 40Ohms; Load Capacitance: 9pF; Unit Weight: 0.000564oz; Drive Level: 200uW; Datasheet Version: 12/2015; RoHS: True; Operating Temperature Range: -40Cto+85C; Length: 3.2mm; Tolerance: 10PPM; Width: 2.5mm; Mounting Technology: SurfaceMount; Package Description: 4-Pin Surface Mount Device, Body 3.2 x 2.5 mm; Manufacturer URL: https://www.eea.epson.com/; Factory Pack Quantity: 250; Package Reference: TSX-3225; Height: 0.6mm; Mounting Style: SMD/SMT; Termination Style: SMD/SMT; Datasheet URL: https://support.epson.biz/td/api/doc_check.php?dl=brief_FA-238V_en.pdf; Type: Crystal; Series: TSX-3225; Package / Case: 3.2mmx2.5mm; Product Category: Crystals; Packaging: Reel
Y1 = CMP-2000-07587-1: Tuning Fork Crystal, 32.768 KHz, +/- 20 ppm, -40 to 85 degC, 2-Pin SMD, RoHS, Tape and Reel; Manufacturer: Abracon; Case\/Package: SMD/SMT; Series Resistance: 60KOhm; Frequency Tolerance: 20ppm; Load Capacitance: 6pF; ESR (Equivalent Series Resistance): 55KOhm; Max Operating Temperature: 85degC; Width: 0.061inch; Radiation Hardening: No; Lead Free: LeadFree; RoHSCompliant: True; Depth: 1.5mm; Datasheet URL: http://www.abracon.com/Resonators/ABS07-120-32.768kHz-T.pdf; Frequency: 32.768KHz; Termination: SMD/SMT; Manufacturer URL: http://www.abracon.com/; Package Quantity: 3000; Packaging: TapeandReel; Number of Pins: 2; Height: 0.035inch; Package Description: 2-Pin Surface Mount Device, Body 3.2 x 1.5 mm; Package Reference: ABS07; Mount: SurfaceMount; Tolerance: 20ppm; Mounting Technology: SurfaceMount; REACH SVHC: NoSVHC; Datasheet Version: 11/2014; Length: 3.2mm; Min Operating Temperature: -40degC

## Sheet 01. MAIN.SchDoc
size A

## Sheet 04. Z-WAVE.SchDoc
size A
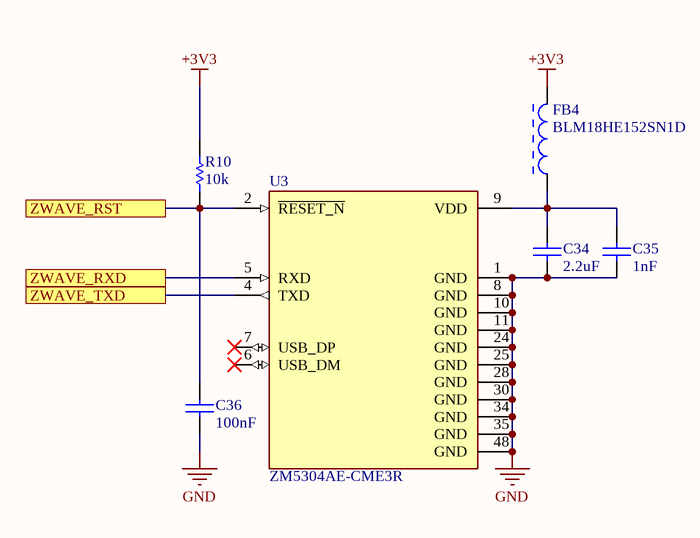
[diagram p2: 04. Z-WAVE.SchDoc]

### Parts
C34  2.2uF  [CAPC1608X90X35NL10T15]
C35  1nF  [CAPC1005X55X25NL05T10]
C36  100nF  [CAPC1005X56X25NL10T15]
FB4  BLM18HE152SN1D  [MURA-BLM18-RF-H4-CHIP-2_V]
R10  10k  [RESC1005X40X25NL05T05]
U3  ZM5304AE-CME3R  [ZM5304AE-CME3R]

### Ports
ZWAVE_RST, ZWAVE_RXD, ZWAVE_TXD

### Nets
+3V3: FB4.2 R10.2
GND: C34.1 C35.1 C36.1 U3.1(GND) U3.8(GND) U3.10(GND) U3.11(GND) U3.24(GND) U3.25(GND) U3.28(GND) U3.30(GND) U3.34(GND) U3.35(GND) U3.48(GND)
NetC34_2: C34.2 C35.2 FB4.1 U3.9(VDD)
NetC36_2: C36.2 R10.1 U3.2(~{RESET_N}) ; port ZWAVE_RST
NetR42_2: U3.4(TXD) ; port ZWAVE_TXD
NetR43_2: U3.5(RXD) ; port ZWAVE_RXD

Not connected (* = marked no-connect by the designer): U3 6(USB_DM)* 7(USB_DP)*

### Library data of the parts
C34 = CMP-2006-02354-1: as C2 on sheet 02. CPU
C35 = CMP-2008-04254-1: as C7 on sheet 03. ZIGBEE
C36 = CMP-2008-02743-1: as C1 on sheet 02. CPU
FB4 = CMP-0686-00368-2: as FB1 on sheet 02. CPU; Packing: Tape and Reel; DatasheetVersion: 08/2013; ComponentLink1URL: http://www.murata.com/; Mounting Technology: Surface Mount; ComponentLink2URL: http://www.murata.com/products/catalog/pdf/c31e.pdf; ComponentLink3Description: Package Specification; ComponentLink2Description: Datasheet; PackageReference: BLM18_H950-2; ComponentLink1Description: Manufacturer URL; PackageDescription: 2-Pin Chip, Body 1.6 x 0.8 mm; ComponentLink3URL: http://www.murata.com/products/catalog/pdf/c31e.pdf; PartNumber: BLM18HE152SN1D; Operating Temperature Range: -55 to 125 degC
R10 = CMP-2002-08135-1: as R1 on sheet 02. CPU
U3 = ZM5304AE-CME3R: General ISM < 1GHz Z-WaveÂ® Transceiver Module 868MHz Surface Mount; MF: Silicon Labs; SnapEDA_Link: https://www.snapeda.com/parts/ZM5304AE-CME3R/Silicon%20Labs/view-part/214706/?ref=snap; Digi-Key_Part_Number: 703-1074-1-ND; MP: ZM5304AE-CME3R; Value: *; Package: Module Sigma Designs; Digi-Key_Purchase_URL: https://www.digikey.com/product-detail/en/silicon-labs/ZM5304AE-CME3R/703-1074-1-ND/4135431?utm_source=snapeda&utm_medium=aggregator&utm_campaign=symbol

## Sheet 06. ETHERNET.SchDoc
size A
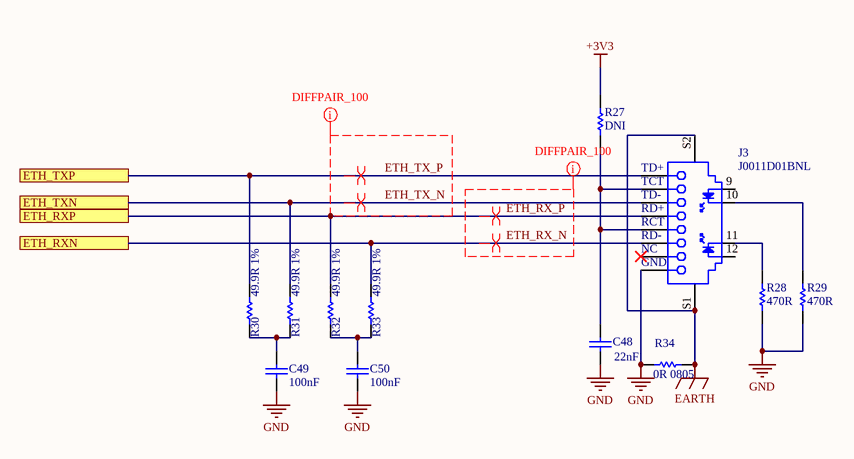
[diagram p3: 06. ETHERNET.SchDoc]

### Parts
C48  22nF  [CAPC1005X60X30LL05T10]
C49  100nF  [CAPC1005X60X30LL05T10]
C50  100nF  [CAPC1005X60X30LL05T10]
J3  J0011D01BNL  [J0011D01BNL 1PORT 100 BASE-TX]
R27  DNI  [RESC1005X40X25LL05T05]
R28  470R  [RESC1005X40X25LL05T05]
R29  470R  [RESC1005X40X25LL05T05]
R30  49.9R 1%  [RESC1005X40X25LL05T05]
R31  49.9R 1%  [RESC1005X40X25LL05T05]
R32  49.9R 1%  [RESC1005X40X25LL05T05]
R33  49.9R 1%  [RESC1005X40X25LL05T05]
R34  0R 0805  [RESC2013X50X30LL20T20]

### Ports
ETH_RXN, ETH_RXP, ETH_TXN, ETH_TXP

### Nets
+3V3: R27.2
EARTH: J3.S1 J3.S2 R34.2
GND: C48.1 C49.1 C50.1 J3.8(GND) R28.1 R29.1 R34.1
ETH_RX_N: J3.6(RD-) R33.2 ; port ETH_RXN
ETH_RX_P: J3.4(RD+) R32.2 ; port ETH_RXP
ETH_TX_N: J3.3(TD-) R31.2 ; port ETH_TXN
ETH_TX_P: J3.1(TD+) R30.2 ; port ETH_TXP
NetC48_2: C48.2 J3.2(TCT) J3.5(RCT) R27.1
NetC49_2: C49.2 R30.1 R31.1
NetC50_2: C50.2 R32.1 R33.1
NetJ3_10: J3.10 R29.2
NetJ3_11: J3.11 R28.2

Not connected (* = marked no-connect by the designer): J3 7(NC)* 9 12

### Layout directives
differential pair: ETH_RX_N, ETH_RX_P, ETH_TX_N, ETH_TX_P
net class ETHERNET; rule Matched Net Lengths [Tolerance = 10mil]: ETH_RX_N, ETH_RX_P, ETH_TX_N, ETH_TX_P

### Library data of the parts
C48 = CMP-2008-04654-1: Part Number: GRM155R71H223KA12D; Manufacturer: Murata
C49 C50 = CMP-2100-03641-1: Chip Capacitor, 0.1 uF, +/- 10%, 16 V, -55 to 125 degC, 0402 (1005 Metric), RoHS, Tape and Reel; Manufacturer: Murata; Material: Ceramic; Insulation Resistance: 10GR; Voltage: 16V; Dielectric: X7R; REACH SVHC: NoSVHC; Depth: 0.5mm; Case/Package: 0402; Datasheet URL: http://psearch.en.murata.com/capacitor/product/GRM155R71C104KA88%23.pdf; Lead Free: LeadFree; Dielectric Material: Ceramic; Manufacturer URL: http://www.murata.com/; Min Operating Temperature: -55degC; Length: 1mm; Case Code (Metric): 1005; Radiation Hardening: No; Package Reference: 0402; RoHSCompliant: true; Datasheet Version: 42675.0; Thickness: 0.022inch; Packaging: TapeandReel; Voltage Rating (DC): 16V; Tolerance: 10%; Max Operating Temperature: 125degC; Package Description: 2-Pin Surface Mount Device, Body 1 x 0.5 mm; Mount: SurfaceMount; Height: 0.5mm; Width: 0.5mm; Number of Pins: 2; Voltage Rating: 16V; Case Code (Imperial): 0402; Termination: SMD/SMT; Capacitance: 100nF; Package Quantity: 1
J3 = CMP-2000-06492-1: RJ45 Connector, Pitch 1.27 mm, 12 Position, Height 13.84 mm, Tail Length 3.3 mm, 0 to 70 degC, RoHS, Tray; Manufacturer: Pulse Electronics; Dynamic Catalog: PULSEJACK™J0andJ2Series; Shield Material: Brass; Shielding: Shielded; LED Color: Green-Yellow; Number of Ports: 1; Number of Cores per Jack: 4; Catalog Drawings: PULSEJACKRightAngle1x1; Other Names: 553-1483 / J0011D01BNL-ND; Tab Direction: Down; Package Description: RJ45 Connector, Pitch 1.27 mm, 12 Position, Height 13.84 mm, Tail Length 3.3 mm; Number of Rows: 1; Contact Finish Thickness: 15µin(0.38µm); Datasheet URL: http://productfinder.pulseeng.com/products/datasheets/J403.pdf; Connector Type: RJ45; Mounting Type: ThroughHole; Package Reference: J0-A; Orientation: 90°Angle(Right); Termination: Solder; Datasheet Version: Rev. K, 08/2012; Applications: 10/100Base-TX,AutoMDIX; Series: PULSEJACK™J0; Contact Finish: Gold; Height Above Board: 0.545"(13.84mm); Operating Temperature: 0°C~70°C; Packaging: Tray; Contact Material: PhosphorBronze; Standard Package: 30; Housing Material: Thermoplastic; Features: BoardGuide; Category: Connectors,Interconnects; Mounting Technology: ThroughHole; Manufacturer URL: http://www.pulseelectronics.com/; Family: ModularConnectors-JacksWithMagnetics
R27 = CMP-2002-03046-1: Part Number: CRCW040210R0FKEDHP; Manufacturer: Vishay Dale
R28 R29 = CMP-2000-03373-1: Part Number: CRCW0603470RFKEA; Manufacturer: Vishay Dale
R30-R33 = CMP-2002-00969-1: Precision Thick Film Chip Resistors; Manufacturer: Panasonic; Part Number: ERJ-2RKF49R9X
R34 = CMP-2001-04896-1: Manufacturer: Vishay Dale; Part Number: CRCW08050000Z0EA

## Sheet 07. POWER.SchDoc
size A
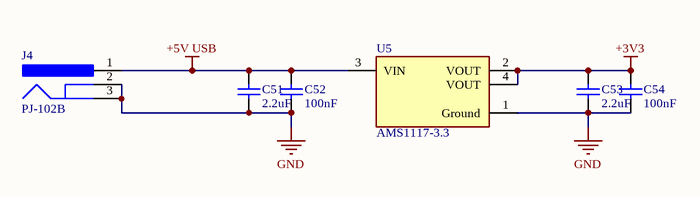
[diagram p4: 07. POWER.SchDoc]

### Parts
C51  2.2uF  [CAPC1608X90X35NL10T15]
C52  100nF  [CAPC1005X56X25NL10T15]
C53  2.2uF  [CAPC1608X90X35NL10T15]
C54  100nF  [CAPC1005X56X25NL10T15]
J4  PJ-102B  [CUI-PJ-102B_V]
U5  AMS1117-3.3  [FP-AMS1117-IPC_B]

### Nets
+3V3: C53.2 C54.2 U5.2(VOUT) U5.4(VOUT)
+5V USB: C51.2 C52.2 J4.1 U5.3(VIN)
GND: C51.1 C52.1 C53.1 C54.1 J4.2 J4.3 U5.1(Ground)

### Library data of the parts
C51 C53 = CMP-2006-02354-1: as C2 on sheet 02. CPU
C52 C54 = CMP-2008-02743-1: as C1 on sheet 02. CPU
J4 = CMP-2000-06900-1: Through Hole Right Angle DC Power Jack, 2.5 A, 2.5 mm Center Pin, 3 Position, -25 to 85 degC, RoHS, Bulk; Manufacturer: CUIInc.; Insulation Resistance: 100MOhms; Inside Contact Diameter: 2.5mm; Outside Contact Diameter: 6.5mm; Voltage Rating: 24V; Current Rating: 2.5A; Brand: CUI; Datasheet URL: http://www.cui.com/product/resource/pj-102b.pdf; Housing Material: PolybutyleneTerephthalate(PBT); Operating Temperature Range: -25Cto+85C; Package Reference: PJ-102B; Factory Pack Quantity: 280; RoHS: True; Contact Material: Copper; Datasheet Version: Rev. 1.03, 04/2016; Product: Jacks; Mounting Angle: Right; Mounting Style: ThroughHole; Flammability Rating: UL94V-0; Product Category: DCPowerConnectors; Contact Gender: Male; Termination Style: ThroughHole; Manufacturer URL: http://www.cui.com/; Mounting Technology: ThroughHole; Package Description: 3-Pin Through Hole Device, Body 14.4 x 9 mm, Height 11 mm; Contact Plating: Nickel; Packaging: Bulk; Connector Type: DCPowerJack
U5 = CMP-209535-000001-1: LDO Voltage Regulators 1A, 3.3V; Manufacturer: Advanced Monolithic Systems; Dropout Voltage: 1.1V; Output Type: Fixed; Nominal Supply Current: 5mA; Max Power Dissipation: 1.2W; Max Supply Voltage: 15V; Number Of Outputs: 1; Standoff Height: 0.64mm; Max Junction Temp: +125°C; Height: 1.8mm; Package: AMS1117; Device Class L2: Power Management ICs; ComponentLink2Description: Datasheet; ComponentLink2URL: http://www.advanced-monolithic.com/pdf/ds1117.pdf; Category: IC; RoHS: TRUE; Automotive: No; Device Class L1: Integrated Circuits (ICs); Output Current: 1A; Device Class L3: Voltage Regulators - Linear; Temperature: -40°C to +125°C; Output Voltage: 3.3V; Manufacturer Part Number: AMS1117-3.3; Temperature Range Low: -40°C; Octopart: https://octopart.com/ams1117-3.3-advanced+monolithic+systems-25899300; Lead Free: Yes; Ipc Land Pattern Name: SOT229P700X180-4; Temperature Range High: +125°C

## Nets that join several sheets
+3V3: 02. CPU (11 pins), 03. ZIGBEE (FB2.1 FB3.1 TP1.1), 04. Z-WAVE (FB4.2 R10.2), 06. ETHERNET (R27.2), 07. POWER (C53.2 C54.2 U5.2 U5.4)
+5V USB: 02. CPU (FB5.1), 07. POWER (C51.2 C52.2 J4.1 U5.3)
EARTH: 02. CPU (J2.5 J2.6), 06. ETHERNET (J3.S1 J3.S2 R34.2)
GND: 02. CPU (28 pins), 03. ZIGBEE (49 pins), 04. Z-WAVE (14 pins), 06. ETHERNET (7 pins), 07. POWER (7 pins)
ETH_RX_N: 02. CPU (.42), 06. ETHERNET (J3.6 R33.2)
ETH_RX_P: 02. CPU (.41), 06. ETHERNET (J3.4 R32.2)
ETH_TX_N: 02. CPU (.44), 06. ETHERNET (J3.3 R31.2)
ETH_TX_P: 02. CPU (.43), 06. ETHERNET (J3.1 R30.2)
NetC36_2: 02. CPU (R13.2), 04. Z-WAVE (C36.2 R10.1 U3.2)
NetR12_1: 02. CPU (.45), 03. ZIGBEE (R12.1 TP6.1)
NetR42_2: 02. CPU (R42.2), 04. Z-WAVE (U3.4)
NetR43_2: 02. CPU (R43.2), 04. Z-WAVE (U3.5)
NetR44_2: 02. CPU (R44.2), 03. ZIGBEE (U2.16)
NetR45_2: 02. CPU (R45.2), 03. ZIGBEE (U2.17)
PA2: 02. CPU (.55), 03. ZIGBEE (U2.18)
PA3: 02. CPU (.56), 03. ZIGBEE (U2.19)
PA4: 02. CPU (.57), 03. ZIGBEE (U2.20)
PA5: 02. CPU (.58), 03. ZIGBEE (U2.21)
PA6: 02. CPU (.59), 03. ZIGBEE (U2.22)
PA7: 02. CPU (.60), 03. ZIGBEE (U2.23)
PB0: 02. CPU (R21.1 R49.1), 03. ZIGBEE (U2.5)
PB1: 02. CPU (R20.1 R48.1), 03. ZIGBEE (U2.54)
PB2: 02. CPU (R47.1), 03. ZIGBEE (U2.53)
PB3: 02. CPU (R46.1), 03. ZIGBEE (U2.52)
PB4: 02. CPU (R11.1), 03. ZIGBEE (U2.51)
PB5: 02. CPU (R22.1), 03. ZIGBEE (U2.50)
PC0: 02. CPU (R6.2), 03. ZIGBEE (U2.14)
PC1: 02. CPU (R50.2), 03. ZIGBEE (U2.13)
PC4: 02. CPU (R17.2), 03. ZIGBEE (U2.9)
PC5: 02. CPU (R16.2), 03. ZIGBEE (U2.8)
PC6: 02. CPU (R15.2), 03. ZIGBEE (U2.7)
PC7: 02. CPU (R14.2), 03. ZIGBEE (U2.6)